# Altium schematic sheet Charger.SchDoc
size A
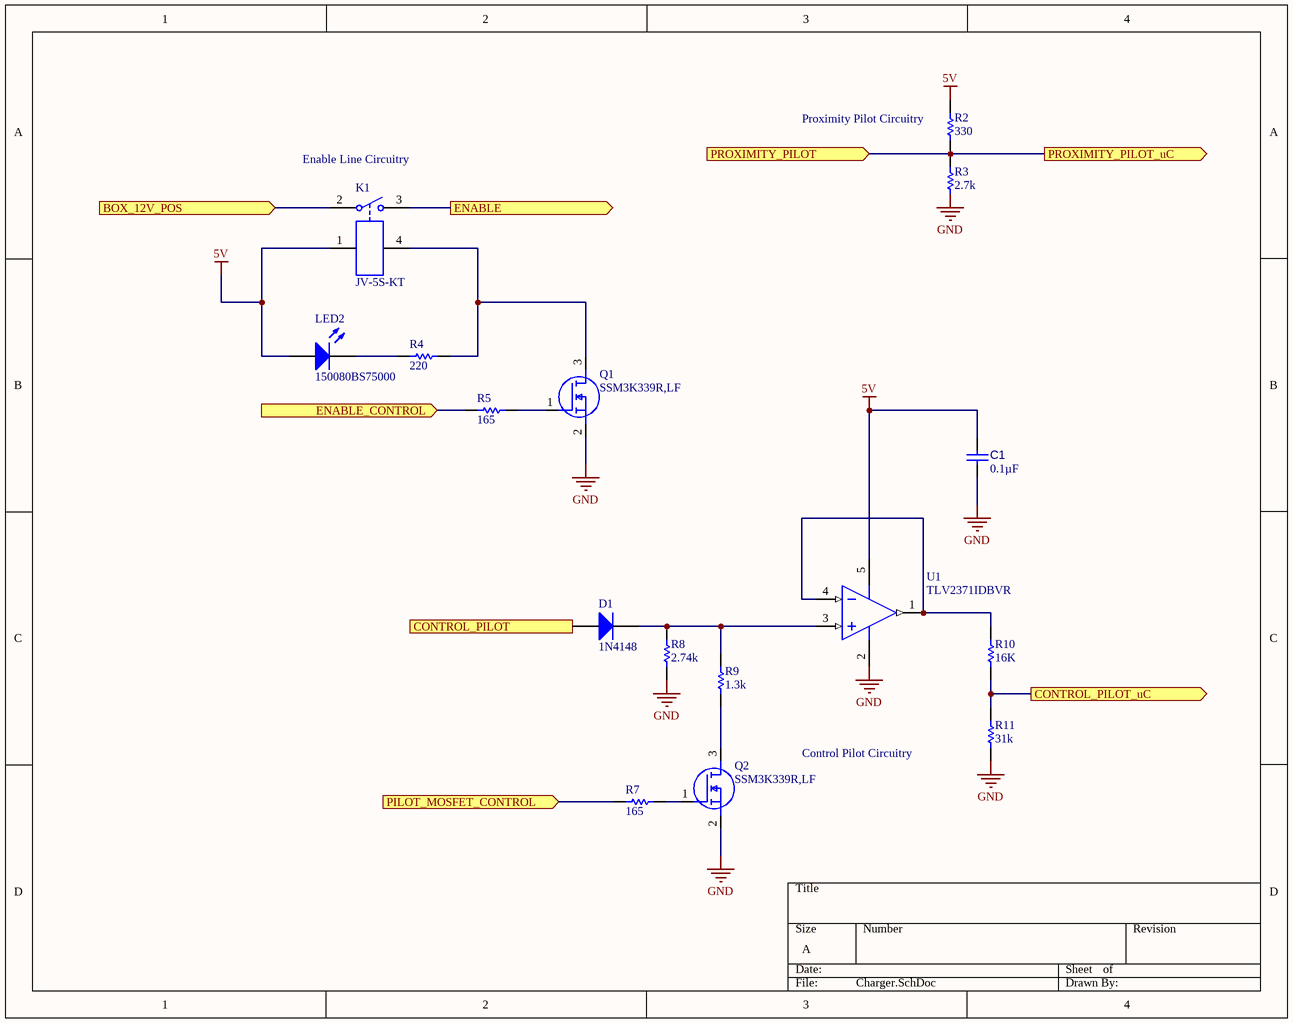
[diagram p0: Charger.SchDoc]

## Parts
C1  0.1µF  [CAPC2013X145X50ML20T25]
D1  1N4148  [NXP-SOD27-2_V]
K1  JV-5S-KT  [FJSU-JV-5S-KT_V]
LED2  150080BS75000  [0805_A]
Q1  SSM3K339R,LF  [SOTFL95P240X88-3N]
Q2  SSM3K339R,LF  [SOTFL95P240X88-3N]
R2  330  [RESC2013X50X35ML15T15]
R3  2.7k  [RESC2013X50X35ML15T15]
R4  220  [RESC2013X50X35ML15T15]
R5  165  [RESC2013X50X35ML15T15]
R7  165  [RESC2013X50X35ML15T15]
R8  2.74k  [RESC2013X50X35ML15T15]
R9  1.3k  [RESC2013X50X35ML15T15]
R10  16K  [RESC2013X50X35ML15T15]
R11  31k  [RESC2013X50X35ML15T15]
U1  TLV2371IDBVR  [DBV0005A_N]

## Ports
BOX_12V_POS (in), CONTROL_PILOT (in), CONTROL_PILOT_uC (out), ENABLE (out), ENABLE_CONTROL (in), PILOT_MOSFET_CONTROL (in), PROXIMITY_PILOT (in), PROXIMITY_PILOT_uC (out)

## Nets
5V: C1.2 K1.1 LED2.2(A) R2.2 U1.5(VDD)
GND: C1.1 Q1.2(S) Q2.2(S) R8.2 R11.2 U1.2(GND)
BOX_12V_POS: K1.2 ; port BOX_12V_POS
CONTROL_PILOT: D1.1(A) ; port CONTROL_PILOT
CONTROL_PILOT_uC: R10.2 R11.1 ; port CONTROL_PILOT_uC
ENABLE: K1.3 ; port ENABLE
ENABLE_CONTROL: R5.1 ; port ENABLE_CONTROL
PILOT_MOSFET_CONTROL: R7.1 ; port PILOT_MOSFET_CONTROL
PROXIMITY_PILOT: R2.1 R3.2 ; port PROXIMITY_PILOT, port PROXIMITY_PILOT_uC
NetD1_2: D1.2(K) R8.1 R9.1 U1.3(IN+)
NetK1_4: K1.4 Q1.3(D) R4.2
NetLED2_1: LED2.1(K) R4.1
NetQ1_1: Q1.1(G) R5.2
NetQ2_1: Q2.1(G) R7.2
NetQ2_3: Q2.3(D) R9.2
NetR10_1: R10.1 U1.1(OUT) U1.4(IN-)

Not connected (* = marked no-connect by the designer): R3 1

## Notes on the sheet
- (near K1) Enable Line Circuitry
- (near R2) Proximity Pilot Circuitry
- (near R11) Control Pilot Circuitry
- Labels drawn without touching a wire or pin: GND

## Library data of the parts
C1 = CMP-001-00010-4: Chip Capacitor, 0.1 uF, +/-10%, 25 V, 0805 (2012 Metric); Manufacturer: KEMET; Manufacturer Part Number: C0805C104K3RACTU; Dielectric Material: Ceramic; Tolerance: 10%; Capacitance: 100nF; Dielectric: X7R; Voltage: 25V; Value: 0.1µF; Supplier 1: Digi-Key; Supplier Part Number 1: 399-1168-1-ND; RoHS: Yes; Category: Ceramic Capacitors; Stock 1: 417116; Pricing 1: 1=0.14000, 10=0.10000, 50=0.05660, 100=0.04680, 500=0.03284, 1000=0.02719 (USD); Mount: Surface Mount; Case/Package: 0805; Min Operating Temperature: -55°C; Max Operating Temperature: 125°C; Packaging: Tape and Reel; Termination: SMD/SMT; Length: 2mm; Height: 0.9mm; Depth: 1.25mm; Radiation Hardening: No; ComponentLink1URL: https://datasheet.ciiva.com/18193/getdatasheetpartid-385649-18193413.pdf?src-supplier=Verical; ComponentLink1Description: https://datasheet.ciiva.com/18193/getdatasheetpartid-385649-18193413.pdf?src-supplier=Verical; ComponentLink2URL: https://datasheet.ciiva.com/7842/kem-c1002-x7r-smd-7842536.pdf?src-supplier=Element14; ComponentLink2Description: https://datasheet.ciiva.com/7842/kem-c1002-x7r-smd-7842536.pdf?src-supplier=Element14; ComponentLink3URL: https://datasheet.ciiva.com/7842/kem-c1002-x7r-smd-7842538.pdf?src-supplier=Element14; ComponentLink3Description: https://datasheet.ciiva.com/7842/kem-c1002-x7r-smd-7842538.pdf?src-supplier=Element14
D1 = CMP-004-00000-1: High Speed Diode, 100 V, 0.45 A, -65 to 175 degC, 2-Pin SOD27, RoHS, Bulk; Manufacturer: Fairchild; Recovery Time: 4ns; Max Surge Current: 4A; Peak Reverse Current: 5uA; Elements: 1; Forward Current: 300mA; Power: 500mW; Forward Voltage: 1V; Package Reference: SOD27; Min Operating Temperature: -65°C; RoHS Compliant: True; Datasheet Version: Aug-04; Max Operating Temperature: 175°C; Pins: 2; Case/Package: DO; Packaging: Bulk; Package URL: http://www.nxp.com/documents/data_sheet/1N4148_1N4448.pdf; Package Quantity: 2000; Manufacturer URL: https://www.fairchildsemi.com/; Diameter: 1.91mm; Datasheet URL: http://www.nxp.com/documents/data_sheet/1N4148_1N4448.pdf
K1 = CMP-008-00001-2: Power Relay, 5 A, 125 Ohm, -40 to 70 degc, 4-Pin THD, RoHS; Manufacturer: Fujitsu; Contact Form: SPST; Operate Time: 8ms; ReleaseDateNum: 42843.325577338; Current Rating: 5A; Datasheet URL: http://www.fujitsu.com/downloads/MICRO/fcai/relays/jv.pdf; Package Reference: JV-5S-KT; Package Description: 4-Pin Through Hole Device, Body 17.5 x 10 mm, Picth 15.24 mm; Max Operating Temperature: 70°C; Min Operating Temperature: -40°C; Pins: 4; Mounting Technology: ThroughHole; RoHS Compliant: True; Datasheet Version: Apr-12
LED2 = CMP-1426-00008-1: SMD mono-color Chip LED, WL-SMCW, Blue; Manufacturer: Wuerth Elektronik; Color: Blue; ComponentLink2URL: http://katalog.we-online.com/led/datasheet/150080BS75000.pdf; ComponentLink1URL: http://www.we-online.com; ComponentLink2Description: Datasheet; PackageReference: 0805_A; ComponentLink1Description: Manufacturer URL; PartNumber: 150080BS75000
Q1 Q2 = SSM3K339R,LF: MOSFET (N-Channel); Manufacturer_Name: Toshiba; Datasheet Link: https://www.arrow.com/en/products/ssm3k339rlf/toshiba; Height: 0.88mm; Manufacturer_Part_Number: SSM3K339R,LF; Arrow Part Number: SSM3K339R,LF; Arrow Price/Stock: https://www.arrow.com/en/products/ssm3k339rlf/toshiba; Mouser Part Number: 757-SSM3K339RLF; Mouser Price/Stock: https://www.mouser.co.uk/ProductDetail/Toshiba/SSM3K339RLF?qs=vPP9GyyTAo2h4IM%252B%252BLvR%252BA%3D%3D
R2 R3 = CMP-009-00001-4: Chip Resistor, 1k Ohm, +/- 1%, 125 mW, -55 to 155 degC, 0805 (2012 Metric)
  R2: Value: 330
  R3: Value: 2.7k
R4 R10 R11 = CMP-009-00001-4: Chip Resistor, 10k Ohm, +/- 1%, 125 mW, -55 to 155 degC, 0805 (2012 Metric)
  R4: Value: 220
  R10: Value: 16K
  R11: Value: 31k
R5 R7 = CMP-009-00001-4: Chip Resistor, 165 Ohm, +/- 1%, 125 mW, -55 to 155 degC, 0805 (2012 Metric); Manufacturer: Panasonic; Manufacturer Part Number: ERA-6AEB1650V; Power Rating: 125mW; Tolerance: 0.1%; Voltage Rating: 100V; Resistance: 165R; Temperature Coefficient: 25ppm/°C; Value: 165; Supplier 1: Digi-Key; Supplier Part Number 1: P165DACT-ND; RoHS: Yes; Category: Chip SMD Resistors; Stock 1: 7632; Pricing 1: 1=0.33000, 10=0.27800, 100=0.10850, 1000=0.04541, 2500=0.04163 (USD); Mount: Surface Mount; Case/Package: 0805; Number of Pins: 2; Case Code (Imperial): 0805; Case Code (Metric): 2012; Contact Plating: Tin; Min Operating Temperature: -55°C; Max Operating Temperature: 155°C; Packaging: Tape and Reel; Composition: Metal Film,Thin Film; Features: Automotive AEC-Q200; Voltage Rating (DC): 100V; Number of Terminations: 2; Termination: Solder; Package Quantity: 1; Max Power Dissipation: 125mW; Length: 2mm; Height: 0.5mm; Width: 1.25mm; Depth: 1.25mm; Radiation Hardening: No; Lead Free: Lead Free; ComponentLink1URL: https://datasheet.ciiva.com/11815/0900766b80eb1d8c-11815736.pdf?src-supplier=RSComponents; ComponentLink1Description: https://datasheet.ciiva.com/11815/0900766b80eb1d8c-11815736.pdf?src-supplier=RSComponents; ComponentLink2URL: https://datasheet.ciiva.com/41450/001181180-da-01-en-widerstand-era-0805-165r-0-1-5000st-41450340.pdf?src-supplier=Conrad; ComponentLink2Description: https://datasheet.ciiva.com/41450/001181180-da-01-en-widerstand-era-0805-165r-0-1-5000st-41450340.pdf?src-supplier=Conrad; ComponentLink3URL: https://datasheet.ciiva.com/5950/485442-5950985.pdf?src-supplier=Farnell; ComponentLink3Description: https://datasheet.ciiva.com/5950/485442-5950985.pdf?src-supplier=Farnell; ComponentLink4URL: https://datasheet.ciiva.com/17207/aoa0000ce26-17207273.pdf?src-supplier=Avnet+Europe; ComponentLink4Description: https://datasheet.ciiva.com/17207/aoa0000ce26-17207273.pdf?src-supplier=Avnet+Europe; ComponentLink5URL: https://datasheet.ciiva.com/7942/485442-7942219.pdf?src-supplier=Element14; ComponentLink5Description: https://datasheet.ciiva.com/7942/485442-7942219.pdf?src-supplier=Element14; ComponentLink6URL: https://datasheet.ciiva.com/9185/aoa0000ce26-9185164.pdf?src-supplier=Avnet; ComponentLink6Description: https://datasheet.ciiva.com/9185/aoa0000ce26-9185164.pdf?src-supplier=Avnet; ComponentLink7URL: https://datasheet.ciiva.com/5950/485442-5950981.pdf?src-supplier=Farnell; ComponentLink7Description: https://datasheet.ciiva.com/5950/485442-5950981.pdf?src-supplier=Farnell; ComponentLink8URL: https://datasheet.ciiva.com/7942/485442-7942220.pdf?src-supplier=Element14; ComponentLink8Description: https://datasheet.ciiva.com/7942/485442-7942220.pdf?src-supplier=Element14
R8 R9 = CMP-009-00001-4: Chip Resistor, 5.1k Ohm, +/- 1%, 125 mW, -55 to 155 degC, 0805 (2012 Metric)
  R8: Value: 2.74k
  R9: Value: 1.3k
U1 = CMP-0272-03303-3: 550 uA/Ch, 3 MHz, RRIO Operational Amplifier, 2.7 to 16 V, -40 to 125 degC, 5-pin SOT23 (DBV5), Green (RoHS & no Sb/Br); Manufacturer: Texas Instruments; Total Supply Voltage(Max)(+5V is 5, +/-5V is 10): 16; Sub Family: Low Supply Voltage Amplifier (<=2.7V), Precision Amplifier; CMRR(Min)(dB): 50; Slew Rate(Typ)(V/us): 2.4; Total Supply Voltage(Min)(+5V is 5, +/-5V is 10): 2.7; Packing: LARGE T&R; Vio (25C)(Max)(mV): 4.5; Iq per channel(Max)(mA): 0.9; Number of Channels: 1; Offset Drift(Typ)(uV/C): 2; Rating: Catalog; IIB(Max)(pA): 60; GBW(Typ)(MHz): 3; PackageVersion: 4073253-4/K, 03/2006; ComponentLink3URL: http://www.ti.com/litv/pdf/mpds018i; ComponentLink3Description: Package Specification; ComponentLink1URL: http://www.ti.com/; ComponentLink1Description: Manufacturer URL; PackageDescription: 5-Pin Plastic Small Outline, Body 1.6 x 2.9 mm, Pitch 0.95 mm; PartNumber: TLV2371IDBVR; Code_JEDEC: MO-178; PackageReference: DBV0005A; Eco-Plan: Green (RoHS & no Sb/Br); DatasheetVersion: SLOS270D; ComponentLink2URL: http://www.ti.com/lit/ds/symlink/tlv2371.pdf; ComponentLink2Description: Datasheet; Mounting Technology: Surface Mount